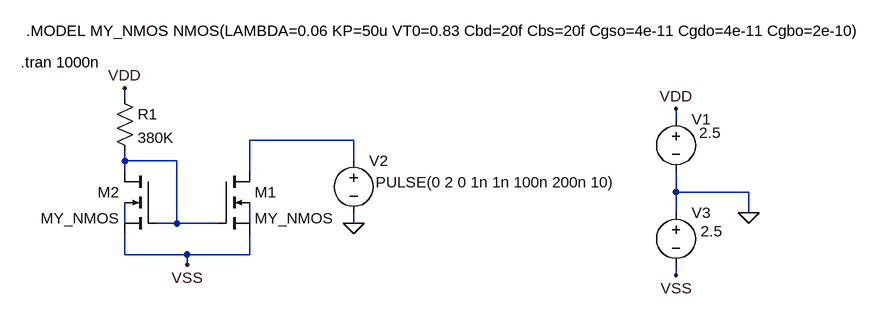
[diagram p0: schematic Transient_Analysis.asc]
Transient_Analysis.asc, the LTspice schematic file:
Version 4
SHEET 1 1320 680
WIRE -16 80 -16 64
WIRE 832 112 832 96
WIRE 336 144 176 144
WIRE -16 176 -16 160
WIRE 64 176 -16 176
WIRE 336 176 336 144
WIRE -16 192 -16 176
WIRE 176 192 176 144
WIRE 832 224 832 192
WIRE 944 224 832 224
WIRE 832 256 832 224
WIRE 944 256 944 224
WIRE -16 272 -16 240
WIRE 64 272 64 176
WIRE 64 272 32 272
WIRE 128 272 64 272
WIRE 176 272 176 240
WIRE 336 272 336 256
WIRE -16 320 -16 288
WIRE 80 320 -16 320
WIRE 176 320 176 288
WIRE 176 320 80 320
WIRE 80 336 80 320
WIRE 832 352 832 336
FLAG 80 336 VSS
FLAG -16 64 VDD
FLAG 336 272 0
FLAG 832 96 VDD
FLAG 832 352 VSS
FLAG 944 256 0
SYMBOL nmos4 128 192 R0
SYMATTR InstName M1
SYMATTR Value MY_NMOS
SYMATTR Value2 l=5u w=15u
SYMBOL nmos4 32 192 M0
SYMATTR InstName M2
SYMATTR Value MY_NMOS
SYMATTR Value2 l=5u w=15u
SYMBOL res -32 64 R0
SYMATTR InstName R1
SYMATTR Value 380K
SYMBOL voltage 832 96 R0
WINDOW 123 0 0 Left 2
WINDOW 39 0 0 Left 2
WINDOW 3 36 37 Left 2
SYMATTR Value 2.5
SYMATTR InstName V1
SYMBOL voltage 336 160 R0
WINDOW 123 0 0 Left 2
WINDOW 39 0 0 Left 2
WINDOW 3 34 49 Left 2
SYMATTR Value PULSE(0 2 0 1n 1n 100n 200n 10)
SYMATTR InstName V2
SYMBOL voltage 832 240 R0
WINDOW 123 0 0 Left 2
WINDOW 39 0 0 Left 2
WINDOW 3 38 44 Left 2
SYMATTR Value 2.5
SYMATTR InstName V3
TEXT -168 -24 Left 2 !.MODEL MY_NMOS NMOS(LAMBDA=0.06 KP=50u VT0=0.83 Cbd=20f Cbs=20f Cgso=4e-11 Cgdo=4e-11 Cgbo=2e-10)
TEXT -176 24 Left 2 !.tran 1000n

The netlist it stands for:
* Transient_Analysis.asc
M1 N001 N002 VSS N004 MY_NMOS l=5u w=15u
M2 N002 N002 VSS N003 MY_NMOS l=5u w=15u
R1 VDD N002 380K
V1 VDD 0 2.5
V2 N001 0 PULSE(0 2 0 1n 1n 100n 200n 10)
V3 0 VSS 2.5
.model NMOS NMOS
.model PMOS PMOS
.lib standard.mos
.MODEL MY_NMOS NMOS(LAMBDA=0.06 KP=50u VT0=0.83 Cbd=20f Cbs=20f Cgso=4e-11 Cgdo=4e-11 Cgbo=2e-10)
.tran 1000n
.backanno
.end